# EAGLE design arduino_mega_shield (EAGLE 7.5.0)
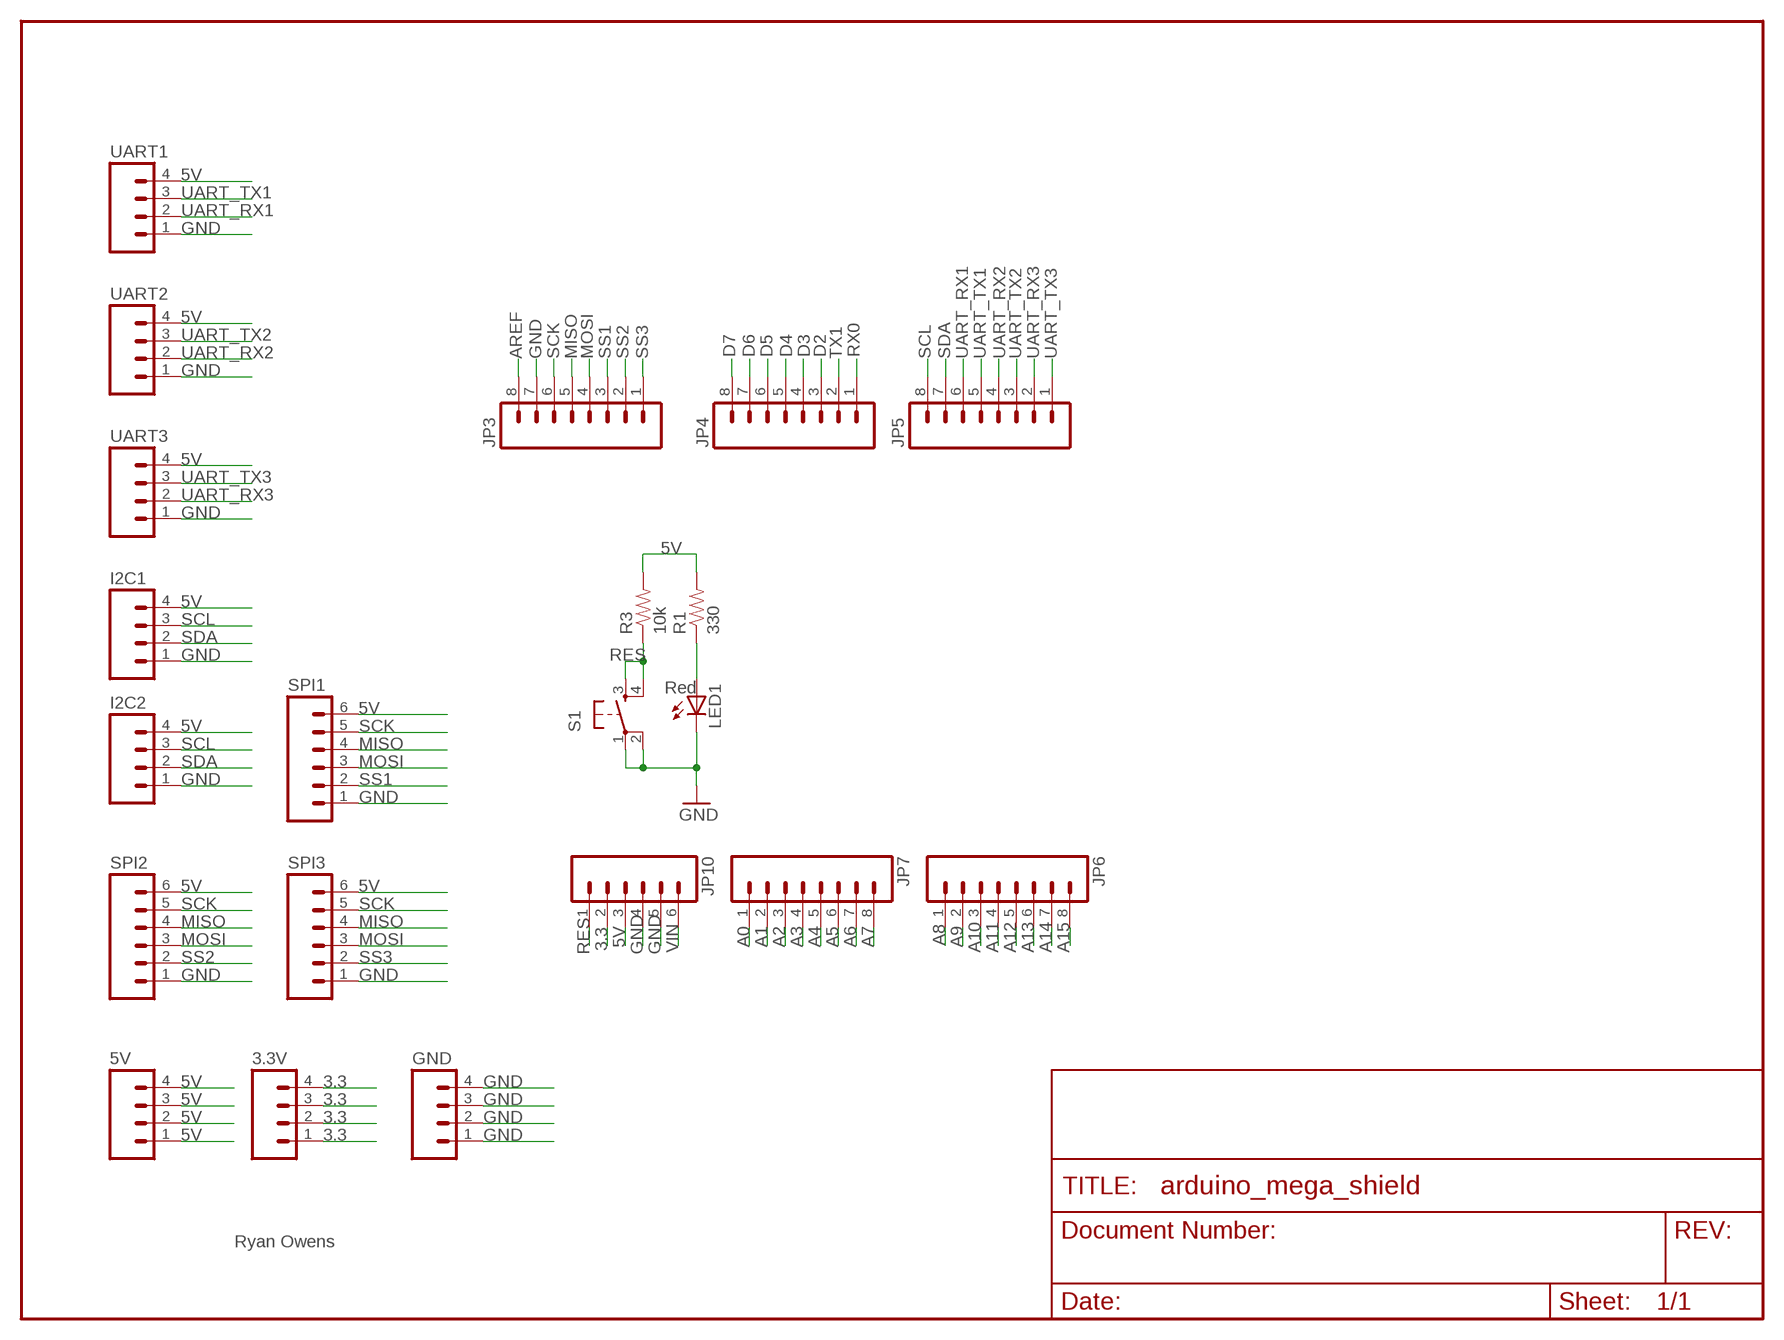
[diagram p0: schematic, sheet 1]

## Parts
3.3V  M04LOCK  [1X04_LOCK]
5V  M04LOCK  [1X04_LOCK]
GND  M04LOCK  [1X04_LOCK]
I2C1  M04LOCK  [1X04_LOCK]
I2C2  M04LOCK  [1X04_LOCK]
JP3  M08LOCK  [1X08_LOCK]
JP4  M08LOCK  [1X08_LOCK]
JP5  M08LOCK  [1X08_LOCK]
JP6  M08LOCK  [1X08_LOCK]
JP7  M08LOCK  [1X08_LOCK]
JP10  M06LOCK  [1X06_LOCK]
LED1  Red  LED5MM  [LED5MM]
R1  330  RESISTORPTH1  [AXIAL-0.3]
R3  10k  RESISTORPTH1  [AXIAL-0.3]
S1  TAC_SWITCHPTH  [TACTILE-PTH]
SPI1  M06LOCK  [1X06_LOCK]
SPI2  M06LOCK  [1X06_LOCK]
SPI3  M06LOCK  [1X06_LOCK]
UART1  M04LOCK  [1X04_LOCK]
UART2  M04LOCK  [1X04_LOCK]
UART3  M04LOCK  [1X04_LOCK]

## Nets
3.3: 3.3V.1 3.3V.2 3.3V.3 3.3V.4 JP10.2
5V: 5V.1 5V.2 5V.3 5V.4 I2C1.4 I2C2.4 JP10.3 R1.P$2 R3.P$2 SPI1.6 SPI2.6 SPI3.6 UART1.4 UART2.4 UART3.4
A0: JP7.1
A1: JP7.2
A2: JP7.3
A3: JP7.4
A4: JP7.5
A5: JP7.6
A6: JP7.7
A7: JP7.8
A8: JP6.1
A9: JP6.2
A10: JP6.3
A11: JP6.4
A12: JP6.5
A13: JP6.6
A14: JP6.7
A15: JP6.8
AREF: JP3.8
D2: JP4.3
D3: JP4.4
D4: JP4.5
D5: JP4.6
D6: JP4.7
D7: JP4.8
GND: GND.1 GND.2 GND.3 GND.4 I2C1.1 I2C2.1 JP3.7 JP10.4 JP10.5 LED1.K(C) S1.1 S1.2 SPI1.1 SPI2.1 SPI3.1 UART1.1 UART2.1 UART3.1
MISO: JP3.5 SPI1.4 SPI2.4 SPI3.4
MOSI: JP3.4 SPI1.3 SPI2.3 SPI3.3
N$126: LED1.A R1.P$1
RES: JP10.1 R3.P$1 S1.3 S1.4
RX0: JP4.1
SCK: JP3.6 SPI1.5 SPI2.5 SPI3.5
SCL: I2C1.3 I2C2.3 JP5.8
SDA: I2C1.2 I2C2.2 JP5.7
SS1: JP3.3 SPI1.2
SS2: JP3.2 SPI2.2
SS3: JP3.1 SPI3.2
TX1: JP4.2
UART_RX1: JP5.6 UART1.2
UART_RX2: JP5.4 UART2.2
UART_RX3: JP5.2 UART3.2
UART_TX1: JP5.5 UART1.3
UART_TX2: JP5.3 UART2.3
UART_TX3: JP5.1 UART3.3
VIN: JP10.6

## Notes on the sheet
- Ryan Owens

## Library data of the parts
3.3V 5V GND I2C1 I2C2 UART1-UART3 = SparkFun-Connectors:M04: Header 4 Standard 4-pin 0.1" header. Use with straight break away headers (SKU : PRT-00116), right angle break away headers (PRT-00553), swiss pins (PRT-00743), machine pins (PRT-00117), and female headers (PRT-00115). Molex polarized connector foot print use with SKU : PRT-08231 with associated crimp pins and housings. 1MM SMD Version SKU: PRT-10208
JP3-JP7 = SparkFun:M08: Header 8 Standard 8-pin 0.1" header. Use with straight break away headers (SKU : PRT-00116), right angle break away headers (PRT-00553), swiss pins (PRT-00743), machine pins (PRT-00117), and female headers (PRT-00115).
JP10 = SparkFun:M06: Header 6 Standard 6-pin 0.1" header. Use with straight break away headers (SKU : PRT-00116), right angle break away headers (PRT-00553), swiss pins (PRT-00743), machine pins (PRT-00117), and female headers (PRT-00115). Molex polarized connector foot print use with SKU : PRT-08094 with associated ...
LED1 = SparkFun:LED: LEDs Standard schematic elements and footprints for 5mm, 3mm, 1206, and 0603 sized LEDs. 5mm - Spark Fun Electronics SKU : COM-00529 (and others)
R1 R3 = SparkFun:RESISTOR: Resistor Basic schematic elements and footprints for 0603, 1206, and PTH 1/10th watt (small) resistors.
S1 = SparkFun:TAC_SWITCH: Momentary Switch Button commonly used for reset or general input. Spark Fun Electronics SKU : COM-00097
SPI1-SPI3 = SparkFun-Connectors:M06: Header 6 Standard 6-pin 0.1" header. Use with straight break away headers (SKU : PRT-00116), right angle break away headers (PRT-00553), swiss pins (PRT-00743), machine pins (PRT-00117), and female headers (PRT-00115). Molex polarized connector foot print use with SKU : PRT-08094 with associated ...

## Board
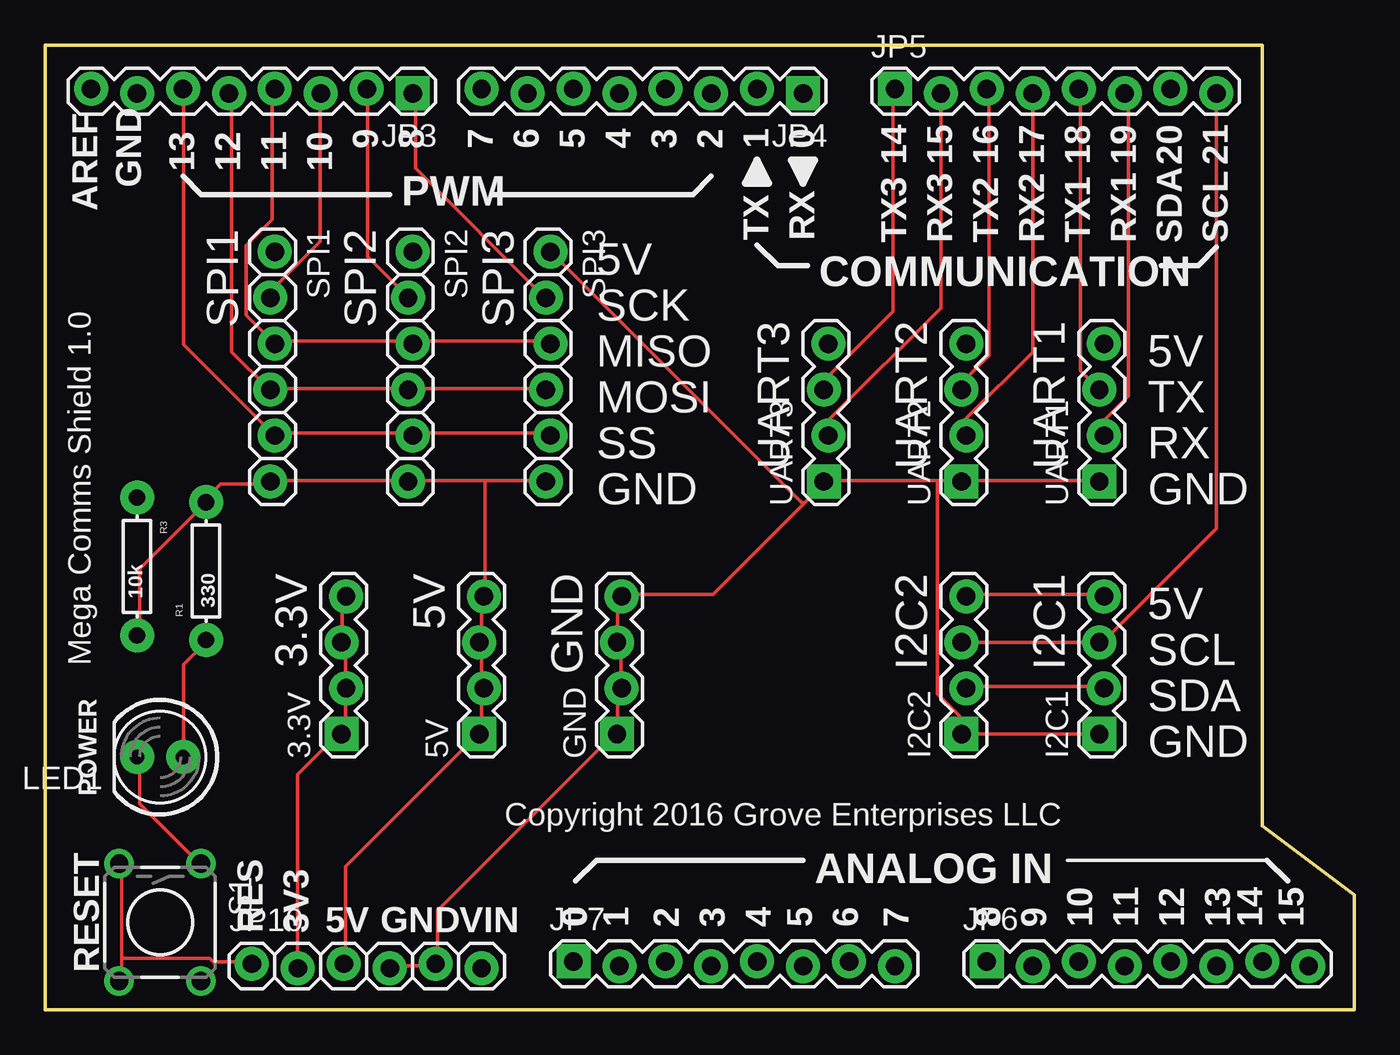
[diagram p1: board, top side]
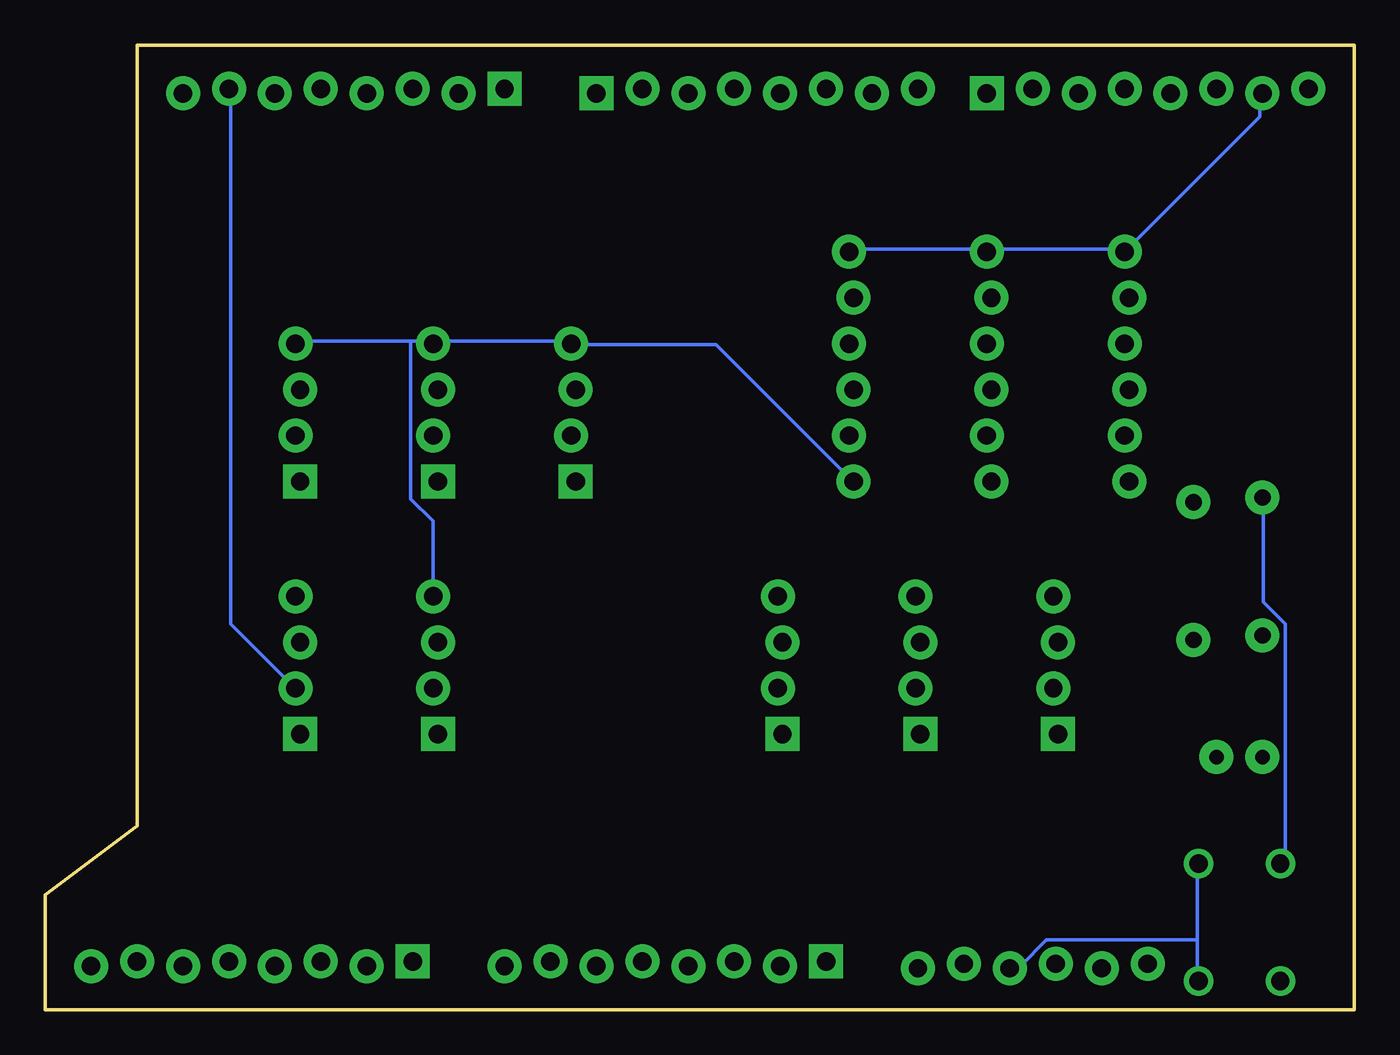
[diagram p2: board, bottom side, seen from below]

Size 72.39 x 53.34 mm. Coordinates in mm from the lower left corner, seen from the top.
Outline: 0,0 72.39,0 72.39,6.35 67.31,10.16 67.31,53.34 0,53.34 0,0
Copper layers (1*16): Top 0.035mm / dielectric 1.5mm / Bottom 0.035mm
Design rules "SparkFun": minimum track width 8mil, minimum drill 20mil, track to track 8mil, track to pad 8mil, pad to pad 8mil, via to via 8mil, smd to smd 8mil, copper to edge 10mil, drill to drill 8mil, minimum pad ring 12mil, minimum via ring 10mil, stop-mask expansion 4mil, vias tented up to drill 25mil, thermal gap 10mil

### Footprints (pad centres in the part's own frame; a part is rotated, then mirrored left to right if it is on the bottom)
1X04_LOCK = drill 1.016 pad 1.88 square: 1 0,0.127 | drill 1.016 pad 1.88: 2 2.54,-0.127; 3 5.08,0.127; 4 7.62,-0.127
1X08_LOCK = drill 1.016 pad 1.88 square: 1 0,0.127 | drill 1.016 pad 1.88: 2 2.54,-0.127; 3 5.08,0.127; 4 7.62,-0.127; 5 10.16,0.127; 6 12.7,-0.127; 7 15.24,0.127; 8 17.78,-0.127
1X06_LOCK = drill 1.016 pad 1.88: 1 0,0; 2 2.54,-0.254; 3 5.08,0; 4 7.62,-0.254; 5 10.16,0; 6 12.7,-0.254
LED5MM = drill 0.813 pad 1.88: A -1.27,0; K 1.27,0
AXIAL-0.3 = drill 0.9 pad 1.88: P$1 -3.81,0; P$2 3.81,0
TACTILE-PTH = drill 1.016: 1 -3.251,2.261; 2 3.251,2.261; 3 -3.251,-2.261; 4 3.251,-2.261

### Placement (x,y rotation side)
3.3V  16.51,15.24 90 top
5V  24.13,15.24 90 top
GND  31.75,15.24 90 top
I2C1  58.42,15.24 90 top
I2C2  50.8,15.24 90 top
JP3  20.32,50.8 180 top
JP4  41.91,50.8 180 top
JP5  46.99,50.8 0 top
JP6  52.07,2.54 0 top
JP7  29.21,2.54 0 top
JP10  11.43,2.54 0 top
LED1  6.35,13.97 180 top
R1  8.89,24.26 90 top
R3  5.08,24.51 270 top
S1  6.35,4.83 270 top
SPI1  12.7,41.91 270 top
SPI2  20.32,41.91 270 top
SPI3  27.94,41.91 270 top
UART1  58.42,29.21 90 top
UART2  50.8,29.21 90 top
UART3  43.18,29.21 90 top

### Tracks (layer width: path | path; a pad name or v marks a point on that pad's centre or on a via)
3.3
  Top 0.203: 16.41,20.32 16.41,22.55 16.61,22.76 3.3V.4 | 16.41,20.32 16.61,20.12 16.61,17.88 3.3V.2 16.61,17.68 16.61,15.44 16.41,15.24 3.3V.1 16.21,15.24 13.97,13.01 JP10.2 | 16.41,20.32 3.3V.3
5V
  Top 0.203: I2C2.4 50.95,22.96 58.47,22.96 I2C1.4 | 24.13,20.32 24.13,22.76 5V.4 24.33,22.96 24.33,29.26 | 24.13,20.32 24.13,17.88 5V.2 24.13,17.68 24.13,15.24 5V.1 23.93,15.24 16.61,7.92 16.61,2.64 JP10.3 | 24.13,20.32 5V.3 | R3.P$2 5.23,20.73 5.23,24.38 8.89,28.04 R1.P$2 8.89,28.25 9.7,29.06 12.34,29.06 SPI1.6 12.55,29.26 20.07,29.26 | 20.07,29.26 24.33,29.26 | 24.33,29.26 27.58,29.26 SPI3.6 | 20.07,29.26 SPI2.6
  Bottom 0.203: 52.17,36.98 50.95,36.98 UART2.4 50.75,36.98 43.43,36.98 UART3.4 43.23,36.78 35.31,36.78 27.79,29.26 SPI3.6 | 52.17,36.98 58.47,36.98 UART1.4 | 52.17,36.98 52.17,28.25 50.95,27.03 50.95,22.96 I2C2.4
GND
  Top 0.203: JP10.4 19.05,2.44 21.49,2.44 JP10.5 21.69,2.64 21.69,5.49 31.44,15.24 GND.1 31.65,15.24 31.65,17.48 31.85,17.68 GND.2 31.85,17.88 31.85,20.12 31.65,20.32 | LED1.K 5.23,13.82 5.23,11.38 8.48,8.13 S1.1 | 31.65,20.32 31.65,22.55 31.85,22.76 GND.4 32.06,22.96 36.93,22.96 42.01,28.04 | 31.65,20.32 GND.3 | I2C1.1 I2C2.1 50.55,15.24 50.55,16.26 49.33,17.48 49.33,29.26 | 49.33,29.26 50.55,29.26 UART2.1 50.75,29.26 58.27,29.26 UART1.1 | 49.33,29.26 43.23,29.26 UART3.1 43.03,29.06 42.01,28.04 | SPI3.1 41.81,28.04 42.01,28.04
  Bottom 0.203: SPI3.1 27.79,42.06 20.47,42.06 SPI2.1 20.27,42.06 12.75,42.06 SPI1.1 5.23,49.38 5.23,50.6 JP3.7 | 8.69,3.86 8.69,7.92 S1.1 | 8.69,3.86 8.69,1.63 S1.2 | 8.69,3.86 17.02,3.86 18.44,2.44 19.05,2.44 JP10.4
MISO
  Top 0.203: 20.07,34.34 12.55,34.34 SPI1.4 12.34,34.34 10.31,36.37 10.31,50.6 JP3.5 | 20.07,34.34 27.58,34.34 SPI3.4 | 20.07,34.34 SPI2.4
MOSI
  Top 0.203: SPI3.3 27.79,36.98 20.47,36.98 SPI2.3 20.27,36.98 12.75,36.98 SPI1.3 11.13,38.41 11.13,42.27 12.55,43.69 12.55,50.8 JP3.4
N$126
  Top 0.203: LED1.A 7.67,14.02 7.67,19.1 8.89,20.32 R1.P$1
RES
  Top 0.203: 4.22,2.85 4.22,7.92 S1.3 | 4.22,2.85 4.22,1.63 S1.4 | 4.22,2.85 9.09,2.85 9.3,2.64 11.33,2.64 JP10.1
  Bottom 0.203: R3.P$1 5.03,28.25 5.03,22.55 3.81,21.34 3.81,8.33 4.01,8.13 S1.3
SCK
  Top 0.203: SPI3.5 27.79,31.9 20.47,31.9 SPI2.5 20.27,31.9 12.75,31.9 SPI1.5 7.67,36.78 7.67,50.8 JP3.6
SCL
  Top 0.203: I2C2.3 I2C1.3 58.47,20.32 64.77,26.62 JP5.8
SDA
  Top 0.203: I2C2.2 50.95,17.88 58.47,17.88 I2C1.2
  Bottom 0.203: JP5.7 62.13,50.8 62.13,21.34 58.67,17.88 I2C1.2
SS1
  Top 0.203: SPI1.2 12.55,39.42 12.55,39.83 15.19,42.47 15.19,50.6 JP3.3
SS2
  Top 0.203: JP3.2 17.83,50.8 17.83,41.66 20.07,39.42 SPI2.2
SS3
  Top 0.203: JP3.1 20.47,50.6 20.47,46.53 27.58,39.42 SPI3.2
UART_RX1
  Top 0.203: UART1.2 58.67,31.9 58.67,32.72 59.89,33.93 59.89,50.39 59.69,50.6 JP5.6
UART_RX2
  Top 0.203: JP5.4 54.61,36.37 50.95,32.72 50.95,31.9 UART2.2
UART_RX3
  Top 0.203: JP5.2 49.53,38.81 43.43,32.72 43.43,31.9 UART3.2
UART_TX1
  Top 0.203: JP5.5 57.25,50.8 57.25,35.36 58.27,34.34 UART1.3
UART_TX2
  Top 0.203: UART2.3 50.75,34.34 50.75,34.75 52.17,36.17 52.17,50.8 JP5.3
UART_TX3
  Top 0.203: UART3.3 43.23,34.34 43.23,34.95 46.89,38.61 46.89,50.8 JP5.1

### Text on the board
tPlace: 9 | 8 | 7 | 6 | 5 | 4 | 3 | 2 | 1 | 0 | 14 | 15 | 16 | 17 | 18 | 19 | 20 | 21 | 13 | 12 | 11 | 10 | GND | AREF | PWM | SPI1 | SPI2 | SPI3 | TX | RX | TX3 | RX3 | TX2 | RX2 | TX1 | RX1 | SDA | SCL | 5V | COMMUNICATION | SCK | UART3 | UART2 | UART1 | MISO | 5V | MOSI | TX | SS | RX | GND | GND | 3.3V | 5V | GND | I2C2 | I2C1 | 5V | Mega Comms Shield 1.0 | SCL | SDA | GND | POWER | Copyright 2016 Grove Enterprises LLC | ANALOG IN | 0 | 1 | 2 | 3 | 4 | 5 | 6 | 7 | 8 | 9 | 10 | 11 | 12 | 13 | 14 | 15 | RES | 3V3 | 5V | GND | VIN | RESET